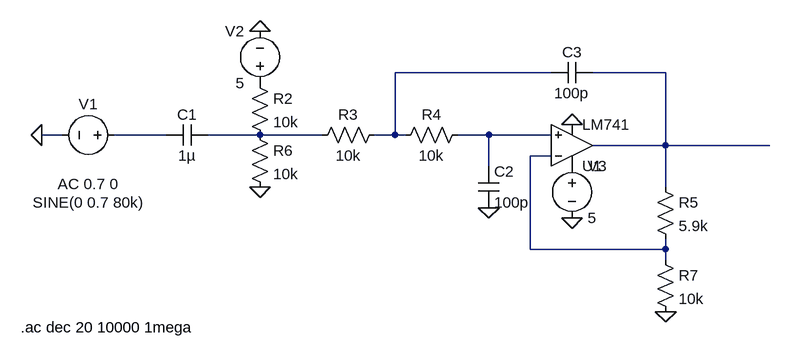
[diagram p0: schematic lpf.asc]
lpf.asc, the LTspice schematic file:
Version 4
SHEET 1 1144 680
WIRE 752 64 512 64
WIRE 928 64 816 64
WIRE 0 160 -32 160
WIRE 160 160 80 160
WIRE 304 160 224 160
WIRE 400 160 304 160
WIRE 512 160 512 64
WIRE 512 160 480 160
WIRE 528 160 512 160
WIRE 656 160 608 160
WIRE 752 160 656 160
WIRE 928 176 928 64
WIRE 928 176 816 176
WIRE 1088 176 928 176
WIRE 752 192 720 192
WIRE 656 208 656 160
WIRE 928 240 928 176
WIRE 720 336 720 192
WIRE 928 336 928 320
WIRE 928 336 720 336
WIRE 928 352 928 336
FLAG 784 144 0
FLAG 928 432 0
FLAG 656 272 0
FLAG -32 160 0
FLAG 784 288 0
FLAG 304 0 0
FLAG 304 240 0
SYMBOL voltage 96 160 R90
WINDOW 0 -32 56 VBottom 2
WINDOW 3 88 56 VTop 2
WINDOW 123 60 56 VTop 2
WINDOW 39 0 0 Left 0
SYMATTR InstName V1
SYMATTR Value SINE(0 0.7 80k)
SYMATTR Value2 AC 0.7 0
SYMBOL res 496 144 R90
WINDOW 0 0 56 VBottom 2
WINDOW 3 32 56 VTop 2
SYMATTR InstName R3
SYMATTR Value 10k
SYMBOL res 624 144 R90
WINDOW 0 0 56 VBottom 2
WINDOW 3 32 56 VTop 2
SYMATTR InstName R4
SYMATTR Value 10k
SYMBOL cap 640 208 R0
SYMATTR InstName C2
SYMATTR Value 100p
SYMBOL LM741 784 240 M180
SYMATTR InstName U1
SYMBOL voltage 784 192 R0
WINDOW 123 0 0 Left 0
WINDOW 39 0 0 Left 0
SYMATTR InstName V3
SYMATTR Value 5
SYMBOL cap 816 48 R90
WINDOW 0 0 32 VBottom 2
WINDOW 3 32 32 VTop 2
SYMATTR InstName C3
SYMATTR Value 100p
SYMBOL res 912 336 R0
SYMATTR InstName R7
SYMATTR Value 10k
SYMBOL res 912 224 R0
SYMATTR InstName R5
SYMATTR Value 5.9k
SYMBOL cap 224 144 R90
WINDOW 0 0 32 VBottom 2
WINDOW 3 32 32 VTop 2
SYMATTR InstName C1
SYMATTR Value 1µ
SYMBOL res 288 64 R0
SYMATTR InstName R2
SYMATTR Value 10k
SYMBOL res 288 144 R0
SYMATTR InstName R6
SYMATTR Value 10k
SYMBOL voltage 304 96 R180
WINDOW 0 24 96 Left 2
WINDOW 3 24 16 Left 2
WINDOW 123 0 0 Left 0
WINDOW 39 0 0 Left 0
SYMATTR InstName V2
SYMATTR Value 5
TEXT -64 456 Left 2 !.ac dec 20 10000 1mega

The netlist it stands for:
* lpf.asc
V1 N003 0 SINE(0 0.7 80k) AC 0.7 0
R3 N001 N004 10k
R4 N005 N001 10k
C2 N005 0 100p
XU1 N005 N006 P001 0 N002 LM741  ; pins In+ In- V+ V- OUT
V3 P001 0 5
C3 N002 N001 100p
R7 N006 0 10k
R5 N002 N006 5.9k
C1 N004 N003 1µ
R2 P002 N004 10k
R6 N004 0 10k
V2 P002 0 5
.ac dec 20 10000 1mega
.lib LM741.lib
.backanno
.end